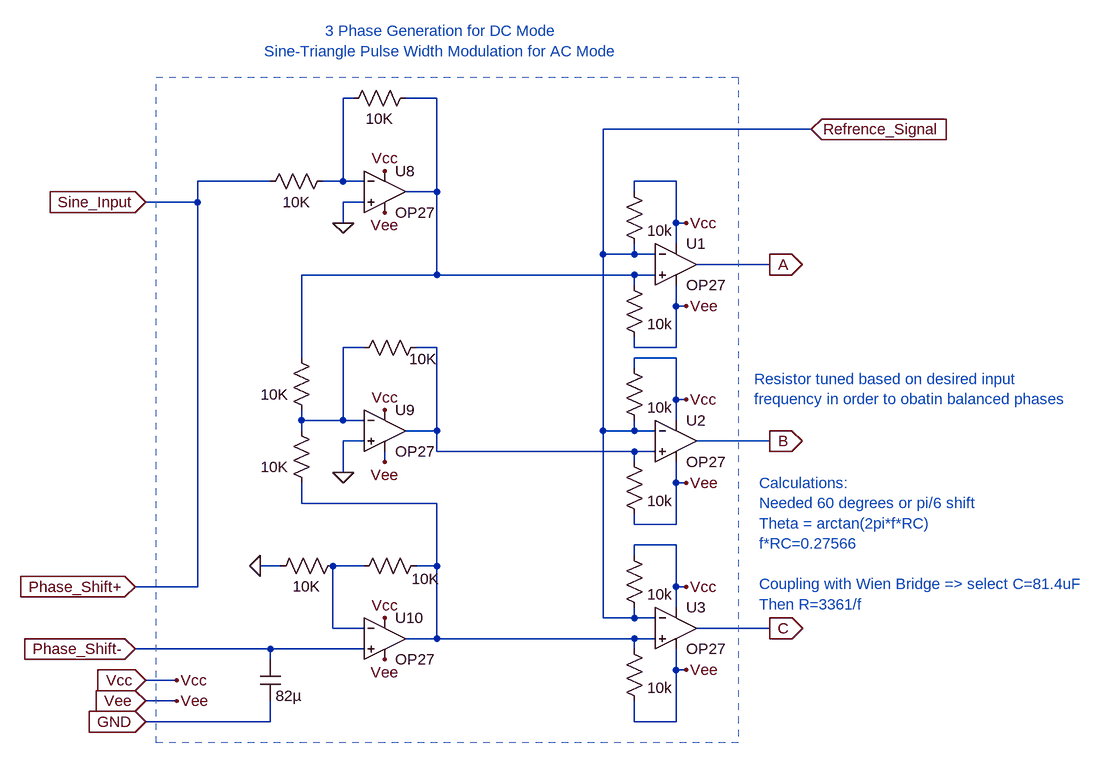
[diagram p0: schematic PWM_Generator.asc]
PWM_Generator.asc, the LTspice schematic file:
Version 4
SHEET 1 2652 680
WIRE -224 -656 -240 -656
WIRE -96 -656 -144 -656
WIRE 480 -608 160 -608
WIRE -352 -528 -464 -528
WIRE -240 -528 -240 -656
WIRE -240 -528 -272 -528
WIRE -208 -528 -240 -528
WIRE 272 -528 208 -528
WIRE -96 -512 -96 -656
WIRE -96 -512 -144 -512
WIRE 208 -512 208 -528
WIRE -464 -496 -464 -528
WIRE -464 -496 -544 -496
WIRE -208 -496 -240 -496
WIRE -240 -464 -240 -496
WIRE 272 -464 272 -528
WIRE 288 -464 272 -464
WIRE 272 -432 272 -464
WIRE 160 -416 160 -608
WIRE 208 -416 208 -432
WIRE 208 -416 160 -416
WIRE 240 -416 208 -416
WIRE 416 -400 304 -400
WIRE -96 -384 -96 -512
WIRE -96 -384 -304 -384
WIRE 208 -384 -96 -384
WIRE 240 -384 208 -384
WIRE 208 -368 208 -384
WIRE 272 -336 272 -368
WIRE 288 -336 272 -336
WIRE -208 -272 -240 -272
WIRE -96 -272 -128 -272
WIRE 208 -272 208 -288
WIRE 272 -272 272 -336
WIRE 272 -272 208 -272
WIRE -304 -256 -304 -384
WIRE 272 -256 208 -256
WIRE 208 -240 208 -256
WIRE 272 -192 272 -256
WIRE 288 -192 272 -192
WIRE -304 -160 -304 -176
WIRE -240 -160 -240 -272
WIRE -240 -160 -304 -160
WIRE -208 -160 -240 -160
WIRE 272 -160 272 -192
WIRE -304 -144 -304 -160
WIRE -96 -144 -96 -272
WIRE -96 -144 -144 -144
WIRE 160 -144 160 -416
WIRE 208 -144 208 -160
WIRE 208 -144 160 -144
WIRE 240 -144 208 -144
WIRE -208 -128 -240 -128
WIRE 416 -128 304 -128
WIRE -96 -112 -96 -144
WIRE 208 -112 -96 -112
WIRE 240 -112 208 -112
WIRE -176 -96 -176 -112
WIRE 208 -96 208 -112
WIRE -240 -80 -240 -128
WIRE 272 -64 272 -96
WIRE 288 -64 272 -64
WIRE -304 -32 -304 -64
WIRE -96 -32 -304 -32
WIRE 208 0 208 -16
WIRE 272 0 272 -64
WIRE 272 0 208 0
WIRE 272 32 208 32
WIRE 208 48 208 32
WIRE -336 64 -368 64
WIRE -208 64 -256 64
WIRE -96 64 -96 -32
WIRE -96 64 -128 64
WIRE -464 96 -464 -496
WIRE -464 96 -560 96
WIRE 272 96 272 32
WIRE 288 96 272 96
WIRE 272 128 272 96
WIRE 160 144 160 -144
WIRE 208 144 208 128
WIRE 208 144 160 144
WIRE 240 144 208 144
WIRE -256 160 -256 64
WIRE -208 160 -256 160
WIRE 416 160 304 160
WIRE -96 176 -96 64
WIRE -96 176 -144 176
WIRE 208 176 -96 176
WIRE 240 176 208 176
WIRE -352 192 -560 192
WIRE -208 192 -352 192
WIRE 208 192 208 176
WIRE -352 208 -352 192
WIRE 272 224 272 192
WIRE 288 224 272 224
WIRE -496 240 -544 240
WIRE -496 272 -544 272
WIRE -352 304 -352 272
WIRE -352 304 -544 304
WIRE 208 304 208 272
WIRE 272 304 272 224
WIRE 272 304 208 304
FLAG -240 -464 0
FLAG -176 -544 Vcc
FLAG -176 -176 Vcc
FLAG -176 144 Vcc
FLAG -368 64 0
FLAG -176 -96 Vee
FLAG -176 208 Vee
FLAG -240 -80 0
FLAG 288 -464 Vcc
FLAG 288 -192 Vcc
FLAG 288 96 Vcc
FLAG 416 -400 A
IOPIN 416 -400 Out
FLAG 416 -128 B
IOPIN 416 -128 Out
FLAG 416 160 C
IOPIN 416 160 Out
FLAG -544 -496 Sine_Input
IOPIN -544 -496 In
FLAG -560 96 Phase_Shift+
IOPIN -560 96 In
FLAG -560 192 Phase_Shift-
IOPIN -560 192 In
FLAG 480 -608 Refrence_Signal
IOPIN 480 -608 In
FLAG -544 272 Vee
IOPIN -544 272 In
FLAG -544 304 GND
IOPIN -544 304 In
FLAG -544 240 Vcc
IOPIN -544 240 In
FLAG -496 272 Vee
FLAG -496 240 Vcc
FLAG -176 -480 Vee
FLAG 288 -64 Vee
FLAG 288 -336 Vee
FLAG 288 224 Vee
SYMBOL Opamps\\OP27 -176 -576 R0
SYMATTR InstName U8
SYMBOL Opamps\\OP27 -176 -208 R0
SYMATTR InstName U9
SYMBOL Opamps\\OP27 -176 112 R0
SYMATTR InstName U10
SYMBOL res -256 -544 R90
WINDOW 0 0 56 Invisible 2
WINDOW 3 32 56 VTop 2
SYMATTR InstName R22
SYMATTR Value 10K
SYMBOL res -128 -672 R90
WINDOW 0 0 56 Invisible 2
WINDOW 3 32 56 VTop 2
SYMATTR InstName R23
SYMATTR Value 10K
SYMBOL res -112 -288 R90
WINDOW 0 0 56 Invisible 2
WINDOW 3 18 5 VTop 2
SYMATTR InstName R26
SYMATTR Value 10K
SYMBOL res -112 48 R90
WINDOW 0 0 56 Invisible 2
WINDOW 3 20 1 VTop 2
SYMATTR InstName R28
SYMATTR Value 10K
SYMBOL res -240 48 R90
WINDOW 0 0 56 Invisible 2
WINDOW 3 32 56 VTop 2
SYMATTR InstName R29
SYMATTR Value 10K
SYMBOL Opamps\\OP27 272 -464 R0
SYMATTR InstName U1
SYMBOL res 192 -528 R0
WINDOW 0 36 40 Invisible 2
SYMATTR InstName R1
SYMATTR Value 10k
SYMBOL res 192 -384 R0
WINDOW 0 36 40 Invisible 2
SYMATTR InstName R2
SYMATTR Value 10k
SYMBOL Opamps\\OP27 272 -192 R0
SYMATTR InstName U2
SYMBOL res 192 -256 R0
WINDOW 0 36 40 Invisible 2
SYMATTR InstName R3
SYMATTR Value 10k
SYMBOL res 192 -112 R0
WINDOW 0 36 40 Invisible 2
SYMATTR InstName R4
SYMATTR Value 10k
SYMBOL Opamps\\OP27 272 96 R0
SYMATTR InstName U3
SYMBOL res 192 32 R0
WINDOW 0 36 40 Invisible 2
SYMATTR InstName R5
SYMATTR Value 10k
SYMBOL res 192 176 R0
WINDOW 0 36 40 Invisible 2
SYMATTR InstName R6
SYMATTR Value 10k
SYMBOL res -288 -160 R180
WINDOW 0 36 76 Invisible 2
WINDOW 3 36 40 Left 2
SYMATTR InstName R7
SYMATTR Value 10K
SYMBOL res -288 -48 R180
WINDOW 0 36 76 Invisible 2
WINDOW 3 36 40 Left 2
SYMATTR InstName R10
SYMATTR Value 10K
SYMBOL cap -368 208 R0
WINDOW 0 24 8 Invisible 2
SYMATTR InstName C2
SYMATTR Value 82µ
TEXT 392 -224 Left 2 ;Resistor tuned based on desired input\nfrequency in order to obatin balanced phases
TEXT -88 -744 Center 2 ;3 Phase Generation for DC Mode\nSine-Triangle Pulse Width Modulation for AC Mode
TEXT 400 -64 Left 2 ;Calculations:\nNeeded 60 degrees or pi/6 shift\nTheta = arctan(2pi*f*RC)\nf*RC=0.27566\n \nCoupling with Wien Bridge => select C=81.4uF\nThen R=3361/f
RECTANGLE Normal 368 336 -528 -688 2

The netlist it stands for:
* PWM_Generator.asc
XU8 0 N001 Vcc Vee N002 OP27  ; pins In+ In- V+ V- OUT
XU9 0 N003 Vcc Vee N004 OP27  ; pins In+ In- V+ V- OUT
XU10 Phase_Shift- N006 Vcc Vee N005 OP27  ; pins In+ In- V+ V- OUT
R22 N001 Phase_Shift+ 10K
R23 N002 N001 10K
R26 N004 N003 10K
R28 N005 N006 10K
R29 N006 0 10K
XU1 N002 Refrence_Signal Vcc Vee A OP27  ; pins In+ In- V+ V- OUT
R1 Vcc Refrence_Signal 10k
R2 N002 Vee 10k
XU2 N004 Refrence_Signal Vcc Vee B OP27  ; pins In+ In- V+ V- OUT
R3 Vcc Refrence_Signal 10k
R4 N004 Vee 10k
XU3 N005 Refrence_Signal Vcc Vee C OP27  ; pins In+ In- V+ V- OUT
R5 Vcc Refrence_Signal 10k
R6 N005 Vee 10k
R7 N003 N002 10K
R10 N005 N003 10K
C2 Phase_Shift- GND 82µ
* Resistor tuned based on desired input
* frequency in order to obatin balanced phases
* 3 Phase Generation for DC Mode
* Sine-Triangle Pulse Width Modulation for AC Mode
* Calculations:
* Needed 60 degrees or pi/6 shift
* Theta = arctan(2pi*f*RC)
* f*RC=0.27566
* Coupling with Wien Bridge => select C=81.4uF
* Then R=3361/f
.lib ADI.lib
.backanno
.end